# EAGLE design d7sch (EAGLE 9.3.2)
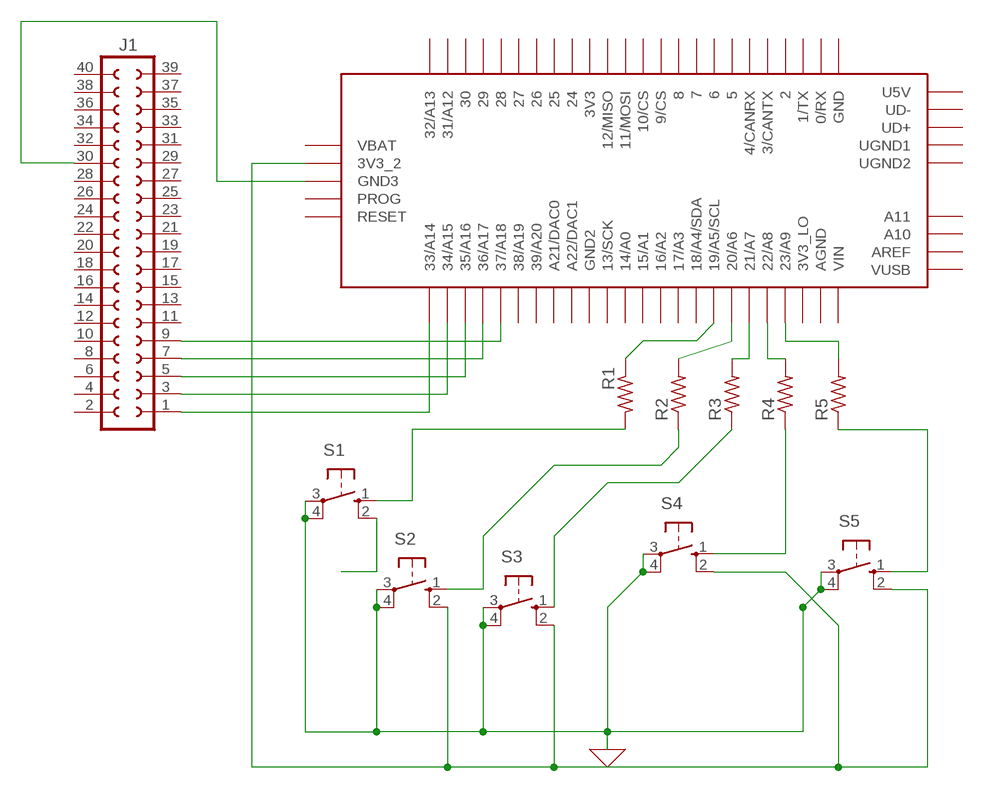
[diagram p0: schematic, sheet 1]

## Parts
J1  SOCKET-40V  [S40V]
R1  R-US_0204/2V  [0204V]
R2  R-US_0204/2V  [0204V]
R3  R-US_0204/2V  [0204V]
R4  R-US_0204/2V  [0204V]
R5  R-US_0204/2V  [0204V]
S1  10-XX  [B3F-10XX]
S2  10-XX  [B3F-10XX]
S3  10-XX  [B3F-10XX]
S4  10-XX  [B3F-10XX]
S5  10-XX  [B3F-10XX]
U$1  TEENSY_3.5/3.6  [TEENSY_3.5/3.6]

## Nets
0: S1.3(P) S1.4(P1) S2.3(P) S2.4(P1) S3.3(P) S3.4(P1) S4.3(P) S4.4(P1) S5.3(P) S5.4(P1) ; supply symbol labelled GND
N$1: J1.30 U$1.GND3
N$2: J1.9 U$1.37/A18
N$3: J1.7 U$1.36/A17
N$4: J1.5 U$1.35/A16
N$5: J1.3 U$1.34/A15
N$6: J1.1 U$1.33/A14
N$7: R1.1 U$1.19/A5/SCL
N$8: R2.2 U$1.20/A6
N$9: R3.2 U$1.21/A7
N$10: R4.2 U$1.22/A8
N$11: R5.2 U$1.23/A9
N$12: R5.1 S5.1(S)
N$13: S2.2(S1) S3.2(S1) S4.2(S1) S5.2(S1) U$1.3V3_2
N$14: R4.1 S4.1(S)
N$15: R3.1 S3.1(S)
N$16: R2.1 S2.1(S)
N$18: R1.2 S1.1(S)
N$19: S1.2(S1)
Unconnected: J1.2 J1.4 J1.6 J1.8 J1.10 J1.11 J1.12 J1.13 J1.14 J1.15 J1.16 J1.17 J1.18 J1.19 J1.20 J1.21 J1.22 J1.23 J1.24 J1.25 J1.26 J1.27 J1.28 J1.29 J1.31 J1.32 J1.33 J1.34 J1.35 J1.36 J1.37 J1.38 J1.39 J1.40 U$1.0/RX U$1.1/TX U$1.2 U$1.3/CANTX U$1.3V3 U$1.3V3_LO U$1.4/CANRX U$1.5 U$1.6 U$1.7 U$1.8 U$1.9/CS U$1.10/CS U$1.11/MOSI U$1.12/MISO U$1.13/SCK U$1.14/A0 U$1.15/A1 U$1.16/A2 U$1.17/A3 U$1.18/A4/SDA U$1.21/DAC0(A21/DAC0) U$1.24 U$1.25 U$1.26 U$1.27 U$1.28 U$1.29 U$1.30 U$1.31/A12 U$1.32/A13 U$1.38/A19 U$1.39/A20 U$1.A10 U$1.A11 U$1.A22/DAC1 U$1.AGND U$1.AREF U$1.GND U$1.GND2 U$1.PROG U$1.RESET U$1.U5V U$1.UD+ U$1.UD- U$1.UGND1 U$1.UGND2 U$1.VBAT U$1.VIN U$1.VUSB

## Library data of the parts
J1 = con-3m-skt-header:SOCKET-40: 40 pin PCB Socket (3m 85xx/51xx)
R1-R5 = rcl:R-US_: RESISTOR, American symbol; SPICEPREFIX: R
S1-S5 = switch-omron:10-XX: OMRON SWITCH; MPN: B3F-1000; OC_FARNELL: 176432; OC_NEWARK: 36M3542
U$1 = Teensy356:TEENSY_3.5/3.6

## Board
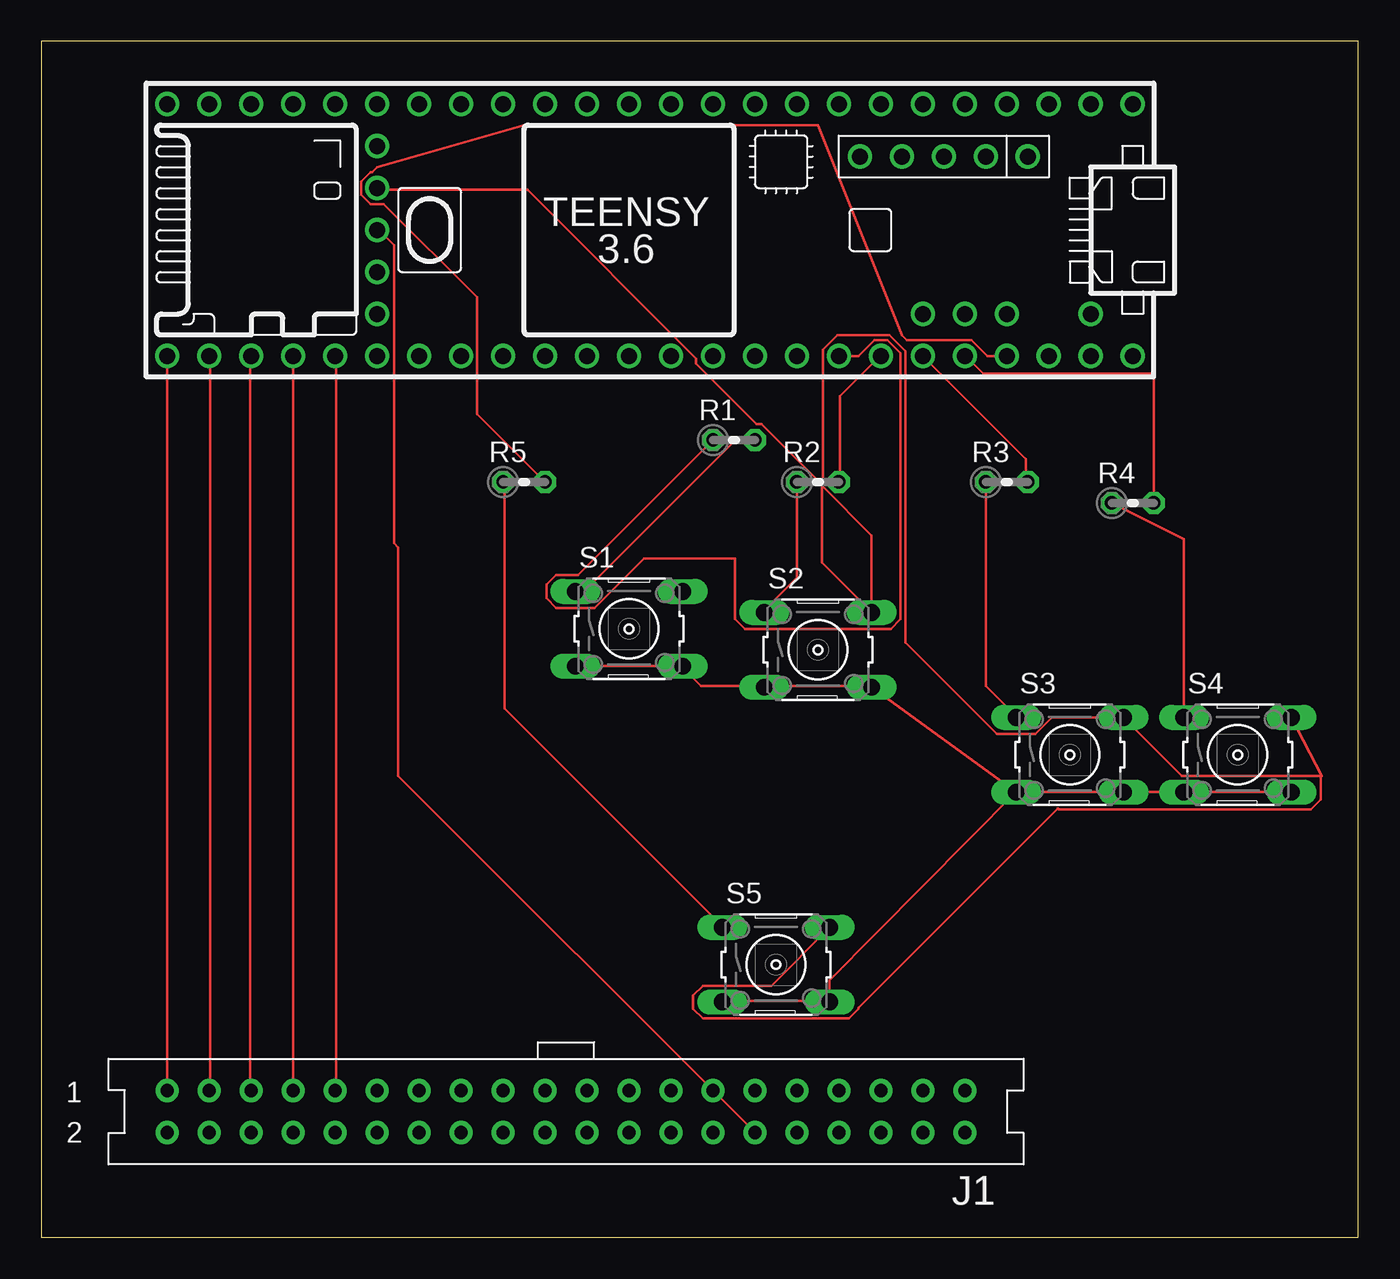
[diagram p1: board, top side]
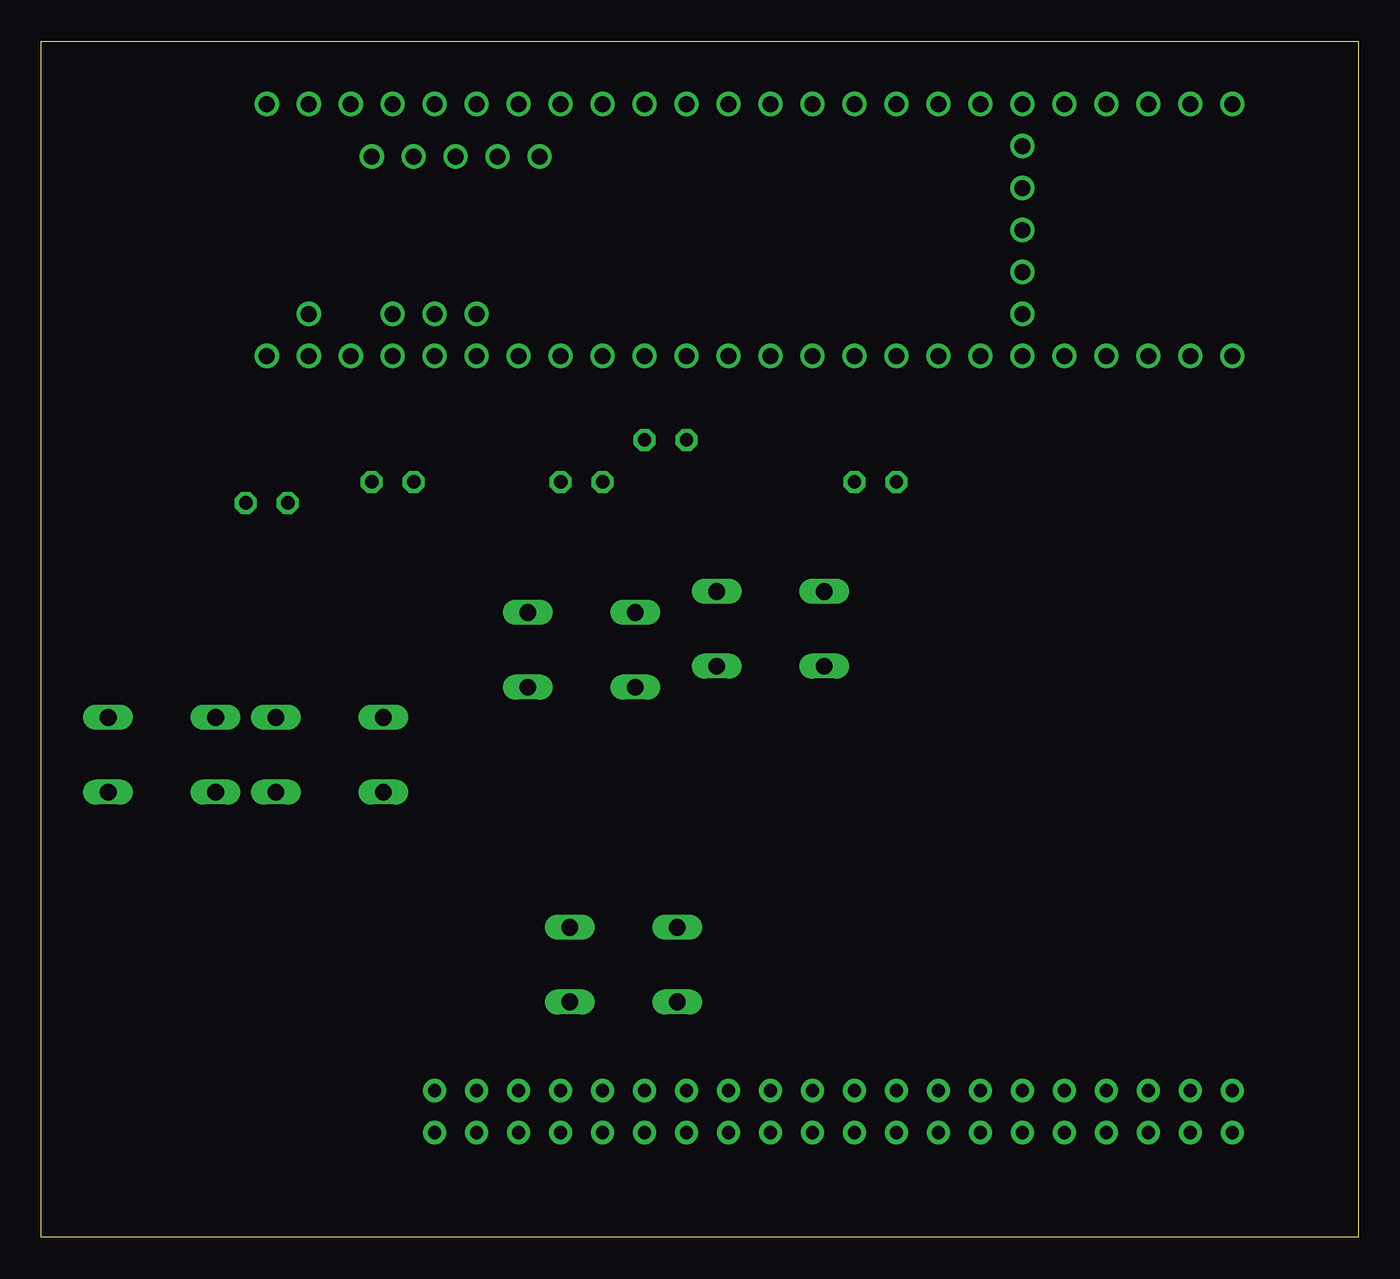
[diagram p2: board, bottom side, seen from below]

Size 79.68 x 72.38 mm. Coordinates in mm from the lower left corner, seen from the top.
Outline: 0,0 79.68,0 79.68,72.38 0,72.38 0,0
Copper layers (1*16): Top 0.035mm / dielectric 1.5mm / Bottom 0.035mm
Design rules "default": minimum track width 6mil, minimum drill 0.35mm, track to track 6mil, track to pad 6mil, pad to pad 6mil, via to via 6mil, smd to smd 6mil, copper to edge 40mil, drill to drill 6mil, minimum pad ring 10mil, minimum via ring 8mil, stop-mask expansion 4mil, vias tented up to drill 0mil, thermal gap 10mil

### Footprints (pad centres in the part's own frame; a part is rotated, then mirrored left to right if it is on the bottom)
S40V = drill 0.8 pad 1.4: 1 24.13,-1.27; 2 24.13,1.27; 3 21.59,-1.27; 4 21.59,1.27; 5 19.05,-1.27; 6 19.05,1.27; 7 16.51,-1.27; 8 16.51,1.27; 9 13.97,-1.27; 10 13.97,1.27; 11 11.43,-1.27; 12 11.43,1.27; 13 8.89,-1.27; 14 8.89,1.27; 15 6.35,-1.27; 16 6.35,1.27; 17 3.81,-1.27; 18 3.81,1.27; 19 1.27,-1.27; 20 1.27,1.27; 21 -1.27,-1.27; 22 -1.27,1.27; 23 -3.81,-1.27; 24 -3.81,1.27; 25 -6.35,-1.27; 26 -6.35,1.27; 27 -8.89,-1.27; 28 -8.89,1.27; 29 -11.43,-1.27; 30 -11.43,1.27; 31 -13.97,-1.27; 32 -13.97,1.27; 33 -16.51,-1.27; 34 -16.51,1.27; 35 -19.05,-1.27; 36 -19.05,1.27; 37 -21.59,-1.27; 38 -21.59,1.27; 39 -24.13,-1.27; 40 -24.13,1.27
0204V = drill 0.813 octagon: 1 -1.27,0; 2 1.27,0
B3F-10XX = drill 1.016 long: 1 -3.251,2.261; 2 3.251,2.261; 3 -3.251,-2.261; 4 3.251,-2.261
TEENSY_3.5/3.6 = drill 0.965: 0/RX -25.4,-7.62; 1/TX -22.86,-7.62; 2 -20.32,-7.62; 3/CANTX -17.78,-7.62; 3V3 7.62,-7.62; 3V3_2 17.78,-2.54; 3V3_LO -22.86,7.62; 4/CANRX -15.24,-7.62; 5 -12.7,-7.62; 6 -10.16,-7.62; 7 -7.62,-7.62; 8 -5.08,-7.62; 9/CS -2.54,-7.62; 10/CS 0,-7.62; 11/MOSI 2.54,-7.62; 12/MISO 5.08,-7.62; 13/SCK 5.08,7.62; 14/A0 2.54,7.62; 15/A1 0,7.62; 16/A2 -2.54,7.62; 17/A3 -5.08,7.62; 18/A4/SDA -7.62,7.62; 19/A5/SCL -10.16,7.62; 20/A6 -12.7,7.62; 21/A7 -15.24,7.62; 21/DAC0 12.7,7.62; 22/A8 -17.78,7.62; 23/A9 -20.32,7.62; 24 10.16,-7.62; 25 12.7,-7.62; 26 15.24,-7.62; 27 17.78,-7.62; 28 20.32,-7.62; 29 22.86,-7.62; 30 25.4,-7.62; 31/A12 27.94,-7.62; 32/A13 30.48,-7.62; 33/A14 30.48,7.62; 34/A15 27.94,7.62; 35/A16 25.4,7.62; 36/A17 22.86,7.62; 37/A18 20.32,7.62; 38/A19 17.78,7.62; 39/A20 15.24,7.62; A10 -17.78,5.08; A11 -15.24,5.08; A22/DAC1 10.16,7.62; AGND -25.4,7.62; AREF -20.32,5.08; GND -27.94,-7.62; GND2 7.62,7.62; GND3 17.78,0; PROG 17.78,2.54; RESET 17.78,5.08; U5V -21.59,-4.445; UD+ -16.51,-4.445; UD- -19.05,-4.445; UGND1 -13.97,-4.445; UGND2 -11.43,-4.445; VBAT 17.78,-5.08; VIN -27.94,7.62; VUSB -25.4,5.08

### Placement (x,y rotation side)
J1  31.75,7.62 180 top
R1  41.91,48.26 0 top
R2  46.99,45.72 0 top
R3  58.42,45.72 0 top
R4  66.04,44.45 0 top
R5  29.21,45.72 0 top
S1  35.56,36.83 0 top
S2  46.99,35.56 0 top
S3  62.23,29.21 0 top
S4  72.39,29.21 0 top
S5  44.45,16.51 0 top
U$1  38.1,60.96 180 top

### Tracks (layer width: path | path; a pad name or v marks a point on that pad's centre or on a via)
0
  Top 0.152: S1.3 32.31,34.6 38.71,34.6 S1.4 38.86,34.44 39.93,33.38 43.74,33.38 | 43.74,33.38 50.14,33.38 S2.4 | 43.74,33.38 S2.3 | 74.37,26.97 75.64,26.97 S4.4 74.37,26.97 | 69.24,26.97 S4.3 | 47.7,14.33 41.3,14.33 S5.3 | 58.98,26.97 65.38,26.97 S3.4 65.53,26.97 69.09,26.97 S4.3 | 58.98,26.97 S3.3 47.7,15.54 47.7,14.33 | 47.7,14.33 S5.4 | 50.29,33.22 S2.4 | 58.98,26.97 S2.4 | 69.29,26.97 S4.3 | 74.37,26.97 69.34,26.97 S4.3
N$1
  Top 0.152: J1.30 21.59,27.94 21.59,41.76 21.34,42.01 21.34,60.05 20.42,60.96 U$1.GND3
  Bottom 0.152: 20.42,60.96 U$1.GND3
N$2
  Top 0.152: J1.9 17.83,8.89 17.83,53.34 U$1.37/A18
N$3
  Top 0.152: U$1.36/A17 J1.7
N$4
  Top 0.152: J1.5 12.65,8.89 12.65,53.34 U$1.35/A16
N$5
  Top 0.152: J1.3 10.21,8.89 10.21,53.34 U$1.34/A15
N$6
  Top 0.152: U$1.33/A14 J1.1
N$7
  Top 0.152: R1.1 32.46,40.08 31.14,40.08 30.56,39.5 30.56,38.68 31.14,38.1 33.48,38.1 36.46,41.08 41.99,41.08 41.99,37.41 42.57,36.83 51.41,36.83 51.99,37.41 51.99,53.51 51.2,54.3 50.4,54.3 49.44,53.34 U$1.19/A5/SCL
  Bottom 0.152: 40.69,48.31 R1.1
N$8
  Top 0.152: R2.2 48.31,45.72 48.31,50.9 50.75,53.34 U$1.20/A6
N$9
  Top 0.152: U$1.21/A7 59.59,47.09 59.59,45.72 R3.2
N$10
  Top 0.152: R4.2 67.31,52.27 57,52.27 55.93,53.34 U$1.22/A8
N$11
  Top 0.152: R5.2 26.36,49.84 26.36,56.89 20.72,62.54 19.92,62.54 19.36,63.1 19.36,63.9 19.92,64.46 20.02,64.46 20.32,64.77 29.21,67.31 46.99,67.31 52.07,54.61 52.38,54.3 56.28,54.3 57.24,53.34 U$1.23/A9
N$12
  Top 0.152: R5.1 28.04,45.72 28.04,32 41.15,18.9 S5.1
N$13
  Top 0.152: U$1.3V3_2 20.42,63.4 29.41,63.4 39.62,53.19 39.62,52.88 43.28,49.23 43.59,49.23 47.24,45.57 47.24,40.84 50.14,37.95 S2.2 50.24,42.48 47.3,45.43 47.3,53.74 48.16,54.61 51.33,54.61 52.3,53.64 52.3,35.99 57.81,30.48 60.15,30.48 61.14,31.47 S3.2 69.01,27.94 77.42,27.94 | S5.2 44.17,15.24 40.03,15.24 39.45,14.66 39.45,13.84 40.03,13.26 48.87,13.26 49.45,13.84 49.45,13.89 61.52,25.96 61.57,25.91 76.81,25.91 77.42,26.52 77.42,27.94 | S4.2 77.47,27.94 77.42,27.94
  Bottom 0.152: 50.14,37.8 S2.2
N$14
  Top 0.152: S4.1 69.14,42.27 R4.1
N$15
  Top 0.152: R3.1 57.15,33.38 58.98,31.55 S3.1
N$16
  Top 0.152: R2.1 45.72,39.93 43.74,37.95 S2.1
N$18
  Top 0.152: R1.2 43.13,48.16 41.91,48.16 32.92,39.17 32.31,39.17 S1.1